# EAGLE design rfid (EAGLE 9.6.2)
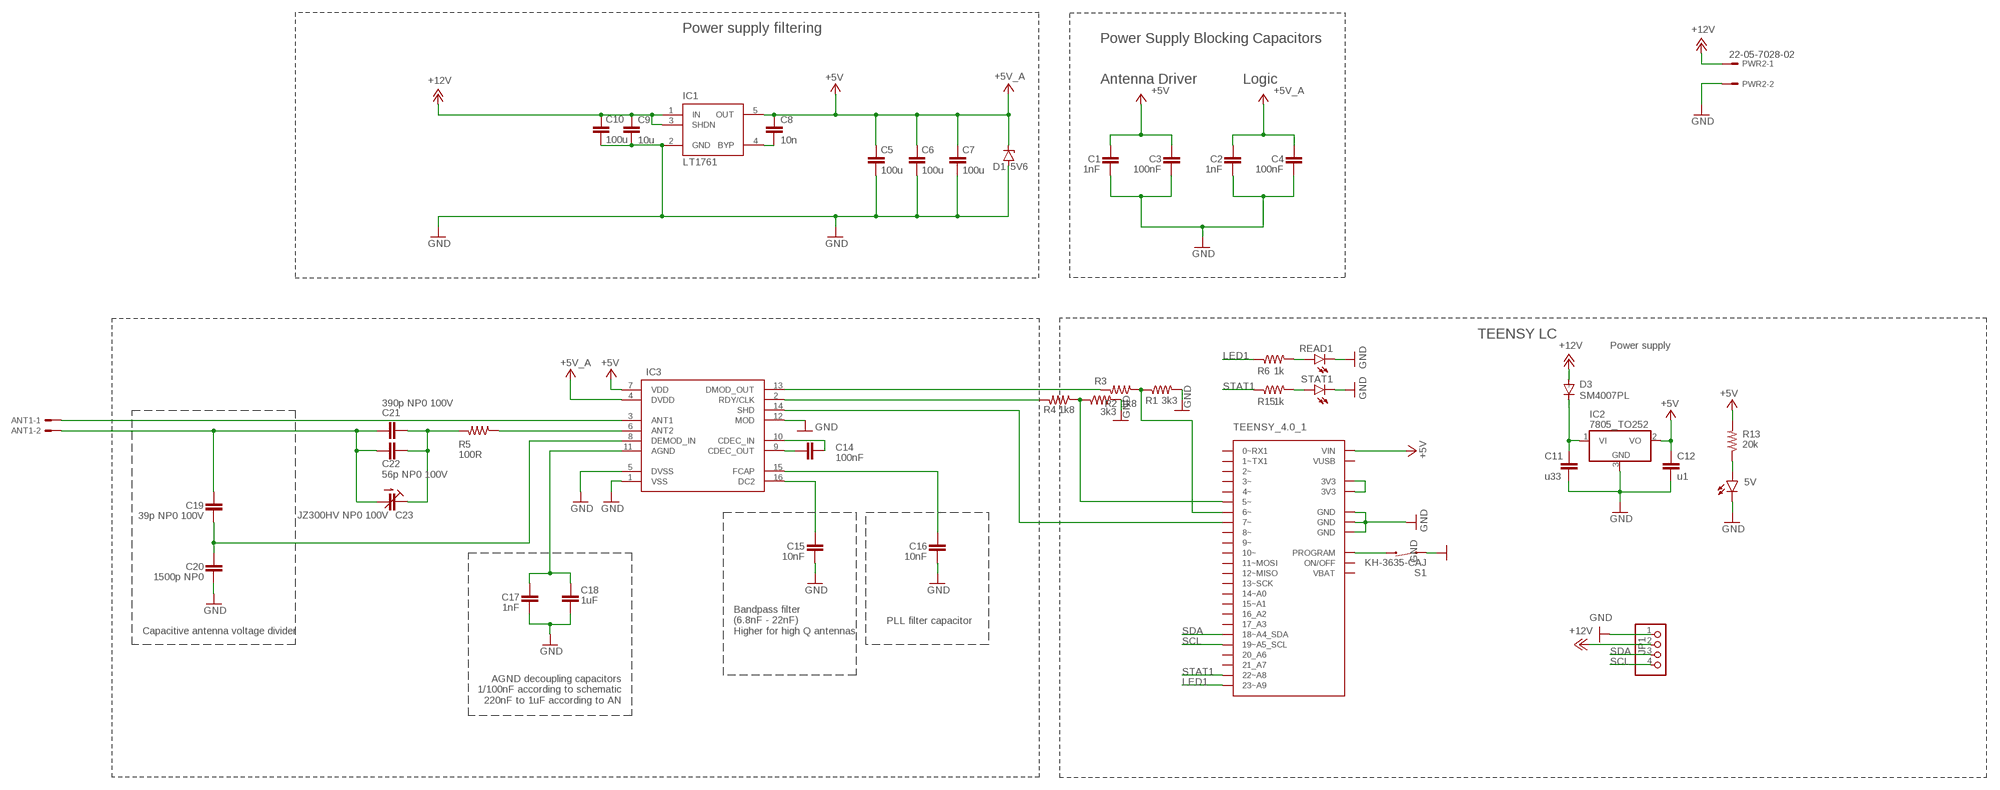
[diagram p0: schematic, sheet 1, part 1 of 2]
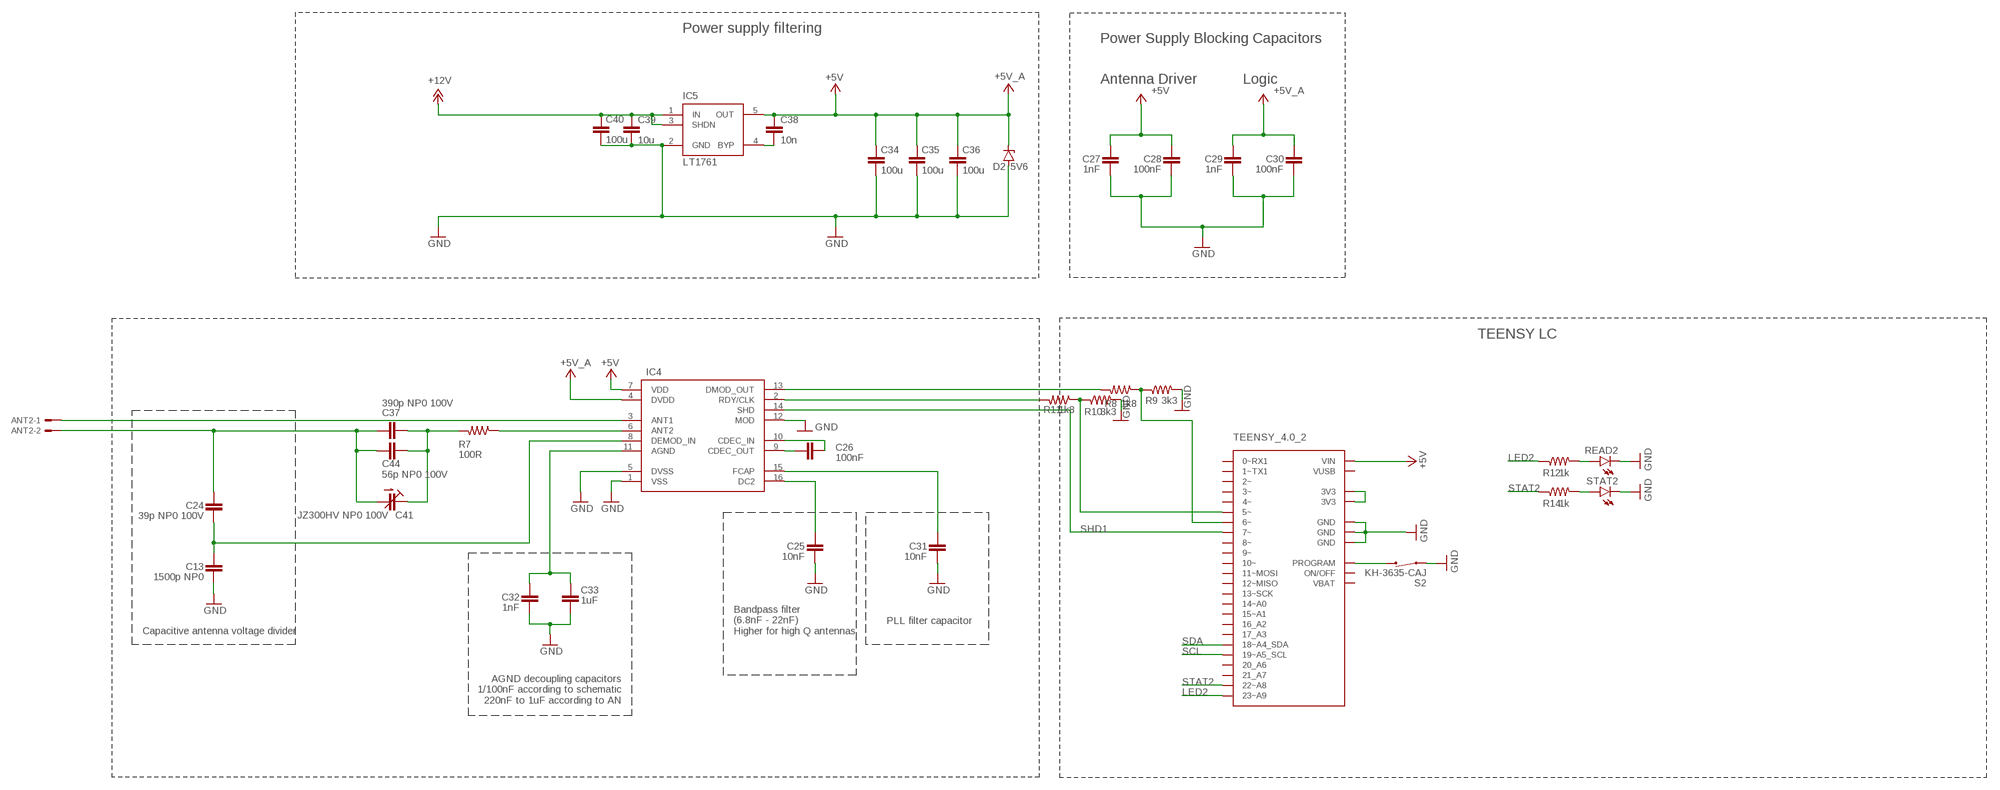
[diagram p1: schematic, sheet 1, part 2 of 2]

## Parts
5V  LEDCHIPLED_0805  [CHIPLED_0805]
ANT1  53261-02  [53261-02]
ANT2  53261-02  [53261-02]
C1  1nF  C1206  [R1206]
C2  1nF  C1206  [R1206]
C3  100nF  C1206  [R1206]
C4  100nF  C1206  [R1206]
C5  100u  C1206  [R1206]
C6  100u  C1206  [R1206]
C7  100u  C1206  [R1206]
C8  10n  C1206  [R1206]
C9  10u  C1206  [R1206]
C10  100u  C1206  [R1206]
C11  u33  C-EUC0805  [C0805]
C12  u1  C-EUC0805  [C0805]
C13  1500p NP0  C1206  [R1206]
C14  100nF  C1206  [R1206]
C15  10nF  C1206  [R1206]
C16  10nF  C1206  [R1206]
C17  1nF  C1206  [R1206]
C18  1uF  C1206  [R1206]
C19  39p NP0 100V  C1206  [R1206]
C20  1500p NP0  C1206  [R1206]
C21  390p NP0 100V  C1206  [R1206]
C22  56p NP0 100V  C1206  [R1206]
C23  JZ300HV NP0 100V  JZ300HV  [JZ300HV]
C24  39p NP0 100V  C1206  [R1206]
C25  10nF  C1206  [R1206]
C26  100nF  C1206  [R1206]
C27  1nF  C1206  [R1206]
C28  100nF  C1206  [R1206]
C29  1nF  C1206  [R1206]
C30  100nF  C1206  [R1206]
C31  10nF  C1206  [R1206]
C32  1nF  C1206  [R1206]
C33  1uF  C1206  [R1206]
C34  100u  C1206  [R1206]
C35  100u  C1206  [R1206]
C36  100u  C1206  [R1206]
C37  390p NP0 100V  C1206  [R1206]
C38  10n  C1206  [R1206]
C39  10u  C1206  [R1206]
C40  100u  C1206  [R1206]
C41  JZ300HV NP0 100V  JZ300HV  [JZ300HV]
C44  56p NP0 100V  C1206  [R1206]
D1  5V6  ZENER-DIODESOD80C  [SOD80C]
D2  5V6  ZENER-DIODESOD80C  [SOD80C]
D3  SM4007PL  CGRM4007-G  [SOD-123_MINI-SMA]
IC1  LT1761  [TSOT23-5]
IC2  7805_TO252  [TO252]
IC3  EM4095  [SO16]
IC4  EM4095  [SO16]
IC5  LT1761  [TSOT23-5]
JP1  PINHD-1X4  [1X04]
PWR2  22-05-7028-02  [7395-02]
R1  3k3  R-US_R0805  [R0805]
R2  1k8  R-US_R0805  [R0805]
R3  3k3  R-US_R0805  [R0805]
R4  1k8  R-US_R0805  [R0805]
R5  100R  R1206  [R1206]
R6  1k  R-US_R0805  [R0805]
R7  100R  R1206  [R1206]
R8  1k8  R-US_R0805  [R0805]
R9  3k3  R-US_R0805  [R0805]
R10  3k3  R-US_R0805  [R0805]
R11  1k8  R-US_R0805  [R0805]
R12  1k  R-US_R0805  [R0805]
R13  20k  R-US_R0805  [R0805]
R14  1k  R-US_R0805  [R0805]
R15  1k  R-US_R0805  [R0805]
READ1  LEDCHIPLED_0805  [CHIPLED_0805]
READ2  LEDCHIPLED_0805  [CHIPLED_0805]
S1  KH-3635-CAJ  [KH-3635-CAJ]
S2  KH-3635-CAJ  [KH-3635-CAJ]
STAT1  LEDCHIPLED_0805  [CHIPLED_0805]
STAT2  LEDCHIPLED_0805  [CHIPLED_0805]
TEENSY_4.0_1  TEENSY40  [TEENSY40]
TEENSY_4.0_2  TEENSY40  [TEENSY40]

## Nets
+5V: C1.2 C2.2 C3.2 C4.2 C5.1 C6.1 C7.1 C8.1 C12.1 C27.2 C28.2 C29.2 C30.2 C34.1 C35.1 C36.1 C38.1 D1.C D2.C IC1.5(OUT) IC2.2(VO) IC3.4(DVDD) IC3.7(VDD) IC4.4(DVDD) IC4.7(VDD) IC5.5(OUT) R13.2 TEENSY_4.0_1.VIN TEENSY_4.0_2.VIN ; supply symbol labelled +5V_A
+12V: C9.1 C10.1 C39.1 C40.1 D3.A IC1.1(IN) IC1.3(SHDN) IC5.1(IN) IC5.3(SHDN) JP1.2 PWR2.1
AGND: C17.2 C18.2 IC3.11(AGND)
AGND1: C32.2 C33.2 IC4.11(AGND)
ANT2: IC3.6(ANT2) R5.1
ANT3: IC4.6(ANT2) R7.1
ANT4: ANT2.1 IC4.3(ANT1)
CDEC_IN: C14.2 IC3.10(CDEC_IN)
CDEC_IN1: C26.2 IC4.10(CDEC_IN)
CDEC_OUT: C14.1 IC3.9(CDEC_OUT)
CDEC_OUT1: C26.1 IC4.9(CDEC_OUT)
DC1: C25.1 IC4.16(DC2)
DC2: C15.1 IC3.16(DC2)
DMODI: C19.1 C20.2 IC3.8(DEMOD_IN)
DMODI1: C13.2 C24.1 IC4.8(DEMOD_IN)
FCAP: C16.1 IC3.15(FCAP)
FCAP1: C31.1 IC4.15(FCAP)
GND: 5V.C C1.1 C2.1 C3.1 C4.1 C5.2 C6.2 C7.2 C9.2 C10.2 C11.2 C12.2 C13.1 C15.2 C16.2 C17.1 C18.1 C20.1 C25.2 C27.1 C28.1 C29.1 C30.1 C31.2 C32.1 C33.1 C34.2 C35.2 C36.2 C39.2 C40.2 D1.A D2.A IC1.2(GND) IC2.3(GND) IC3.1(VSS) IC3.5(DVSS) IC3.12(MOD) IC4.1(VSS) IC4.5(DVSS) IC4.12(MOD) IC5.2(GND) JP1.1 PWR2.2 R1.2 R3.2 R9.2 R10.2 READ1.C READ2.C S1.P$1 S2.P$1 STAT1.C STAT2.C TEENSY_4.0_1.GND TEENSY_4.0_1.GND@1(GND) TEENSY_4.0_1.GND@2(GND) TEENSY_4.0_2.GND TEENSY_4.0_2.GND@1(GND) TEENSY_4.0_2.GND@2(GND)
LED1: R6.1 TEENSY_4.0_1.23(23~A9)
LED2: R12.1 TEENSY_4.0_2.23(23~A9)
N$1: R6.2 READ1.A
N$2: R3.1 R4.1 TEENSY_4.0_1.5(5~)
N$3: ANT2.2 C24.2 C37.1 C41.P$1(A) C44.1
N$4: C37.2 C41.P$2(E) C44.2 R7.2
N$5: C21.2 C22.2 C23.P$2(E) R5.2
N$6: R1.1 R2.1 TEENSY_4.0_1.6(6~)
N$7: C8.2 IC1.4(BYP)
N$8: S1.P$2 TEENSY_4.0_1.PROG(PROGRAM)
N$9: C38.2 IC5.4(BYP)
N$10: TEENSY_4.0_1.3V3 TEENSY_4.0_1.3V3@2(3V3)
N$11: R8.1 R9.1 TEENSY_4.0_2.6(6~)
N$12: R10.1 R11.1 TEENSY_4.0_2.5(5~)
N$13: R12.2 READ2.A
N$14: ANT1.2 C19.2 C21.1 C22.1 C23.P$1(A)
N$15: IC3.14(SHD) TEENSY_4.0_1.7(7~)
N$16: S2.P$2 TEENSY_4.0_2.PROG(PROGRAM)
N$17: TEENSY_4.0_2.3V3 TEENSY_4.0_2.3V3@2(3V3)
N$18: R14.2 STAT2.A
N$19: R15.2 STAT1.A
N$20: ANT1.1 IC3.3(ANT1)
N$21: C11.1 D3.C IC2.1(VI)
N$22: IC4.13(DMOD_OUT) R8.2
N$23: IC3.2(RDY/CLK) R4.2
N$24: IC3.13(DMOD_OUT) R2.2
N$25: 5V.A R13.1
N$26: IC4.2(RDY/CLK) R11.2
SCL: JP1.4 TEENSY_4.0_1.19(19~A5_SCL) TEENSY_4.0_2.19(19~A5_SCL)
SDA: JP1.3 TEENSY_4.0_1.18(18~A4_SDA) TEENSY_4.0_2.18(18~A4_SDA)
SHD1: IC4.14(SHD) TEENSY_4.0_2.7(7~)
STAT1: R15.1 TEENSY_4.0_1.22(22~A8)
STAT2: R14.1 TEENSY_4.0_2.22(22~A8)
Unconnected: TEENSY_4.0_1.0(0~RX1) TEENSY_4.0_1.1(1~TX1) TEENSY_4.0_1.2(2~) TEENSY_4.0_1.3(3~) TEENSY_4.0_1.4(4~) TEENSY_4.0_1.8(8~) TEENSY_4.0_1.9(9~) TEENSY_4.0_1.10(10~) TEENSY_4.0_1.11(11~MOSI) TEENSY_4.0_1.12(12~MISO) TEENSY_4.0_1.13(13~SCK) TEENSY_4.0_1.14(14~A0) TEENSY_4.0_1.15(15~A1) TEENSY_4.0_1.16(16_A2) TEENSY_4.0_1.17(17_A3) TEENSY_4.0_1.20(20_A6) TEENSY_4.0_1.21(21_A7) TEENSY_4.0_1.ON/OFF TEENSY_4.0_1.VBAT TEENSY_4.0_1.VUSB TEENSY_4.0_2.0(0~RX1) TEENSY_4.0_2.1(1~TX1) TEENSY_4.0_2.2(2~) TEENSY_4.0_2.3(3~) TEENSY_4.0_2.4(4~) TEENSY_4.0_2.8(8~) TEENSY_4.0_2.9(9~) TEENSY_4.0_2.10(10~) TEENSY_4.0_2.11(11~MOSI) TEENSY_4.0_2.12(12~MISO) TEENSY_4.0_2.13(13~SCK) TEENSY_4.0_2.14(14~A0) TEENSY_4.0_2.15(15~A1) TEENSY_4.0_2.16(16_A2) TEENSY_4.0_2.17(17_A3) TEENSY_4.0_2.20(20_A6) TEENSY_4.0_2.21(21_A7) TEENSY_4.0_2.ON/OFF TEENSY_4.0_2.VBAT TEENSY_4.0_2.VUSB

## Notes on the sheet
- Power supply filtering | Power supply filtering
- Power Supply Blocking Capacitors | Power Supply Blocking Capacitors
- Antenna Driver | Logic | Antenna Driver | Logic
- TEENSY LC | TEENSY LC
- Power supply
- PLL filter capacitor | PLL filter capacitor
- Capacitive antenna voltage divider
- Bandpass filter
  (6.8nF - 22nF)
  Higher for high Q antennas
- Capacitive antenna voltage divider
- Bandpass filter
  (6.8nF - 22nF)
  Higher for high Q antennas
- AGND decoupling capacitors
  1/100nF according to schematic
  220nF to 1uF according to AN
- AGND decoupling capacitors
  1/100nF according to schematic
  220nF to 1uF according to AN

## Library data of the parts
5V READ1 READ2 STAT1 STAT2 = led:LED: LED OSRAM: - CHIPLED LG R971, LG N971, LY N971, LG Q971, LY Q971, LO R971, LY R971 LH N974, LH R974 LS Q976, LO Q976, LY Q976 LO Q996 - Hyper CHIPLED LW Q18S LB Q993, LB Q99A, LB R99A - SideLED LS A670, LO A670, LY A670, LG A670, LP A670 LB A673, LV A673, LT A673, LW A673 LH A674 LY A675 LS A676, LA A676, LO A676, LY A676, LW A676 LS A679, LY A679, LG A679 - Hyper Micro SIDELED® LS Y876, LA Y876, LO Y876, LY Y876 LT Y87S - SmartLED LW L88C, LW L88S LB L89C, LB L89S, LG L890 LS L89K, LO L89K, LY L89K LS L896, LA L896, LO L896, LY L896 - TOPLED LS T670, LO T670, LY T670, LG T670, LP T670 LSG T670, LSP T670, LSY T670, LOP T670, LYG T670 LG T671, LOG T671, LSG T671 LB T673, LV T673, LT T673, LW T673 LH T674 LS T676, LA T676, LO T676, LY T676, LB T676, LH T676, LSB T676, LW T676 LB T67C, LV T67C, LT T67C, LS T67K, LO T67K, LY T67K, LW E67C LS E67B, LA E67B, LO E67B, LY E67B, LB E67C, LV E67C, LT E67C LW T67C LS T679, LY T679, LG T679 LS T770, LO T770, LY T770, LG T770, LP T770 LB T773, LV T773, LT T773, LW T773 LH T774 LS E675, LA E675, LY E675, LS T675 LS T776, LA T776, LO T776, LY T776, LB T776 LHGB T686 LT T68C, LB T68C - Hyper Mini TOPLED® LB M676 - Mini TOPLED Santana® LG M470 LS M47K, LO M47K, LY M47K Source: http://www.osram.convergy.de LUXEON: - LUMILED® LXK2-PW12-R00, LXK2-PW12-S00, LXK2-PW14-U00, LXK2-PW14-V00 LXK2-PM12-R00, LXK2-PM12-S00, LXK2-PM14-U00 LXK2-PE12-Q00, LXK2-PE12-R00, LXK2-PE12-S00, LXK2-PE14-T00, LXK2-PE14-U00 LXK2-PB12-K00, LXK2-PB12-L00, LXK2-PB12-M00, LXK2-PB14-N00, LXK2-PB14-P00, LXK2-PB14-Q00 LXK2-PR12-L00, LXK2-PR12-M00, LXK2-PR14-Q00, LXK2-PR14-R00 LXK2-PD12-Q00, LXK2-PD12-R00, LXK2-PD12-S00 LXK2-PH12-R00, LXK2-PH12-S00 LXK2-PL12-P00, LXK2-PL12-Q00, LXK2-PL12-R00 Source: www.luxeon.com KINGBRIGHT: KA-3528ASYC Source: www.kingbright.com
ANT1 ANT2 = con-molex:53?-02: CONNECTOR wire to board 1.25 mm (.049 inch) pitch header; MF: MOLEX; OC_FARNELL: 1125373; OC_NEWARK: unknown
C1-C10 C13-C22 C24-C40 C44 = 000-my_library:C1206
C11 C12 = rcl:C-EU: CAPACITOR, European symbol; SPICEPREFIX: C
C23 C41 = 000-my_library:JZ300HV
D1 D2 = diode:ZENER-DIODE: Z-Diode
D3 = diode:CGRM400*-G: Molded plasitc,JEDEC SOD-123/Mini SMA Source: Comchip CGRM4001-G.pdf
IC1 IC5 = 000-my_library:LT1761
IC2 = 000-my_library:7805_TO252
IC3 IC4 = 000-my_library:EM4095
JP1 = pinhead:PINHD-1X4: PIN HEADER
PWR2 = con-molex:22-?-02: CONNECTOR wire to board 2.54 mm (.1 inch) pitch header; MF: MOLEX; OC_FARNELL: 9731601; OC_NEWARK: unknown
R1-R4 R6 R8-R15 = rcl:R-US_: RESISTOR, American symbol; SPICEPREFIX: R
R5 R7 = 000-my_library:R1206
S1 S2 = 000-my_library:KH-3635-CAJ
TEENSY_4.0_1 TEENSY_4.0_2 = 000-my_library:TEENSY40

## Board
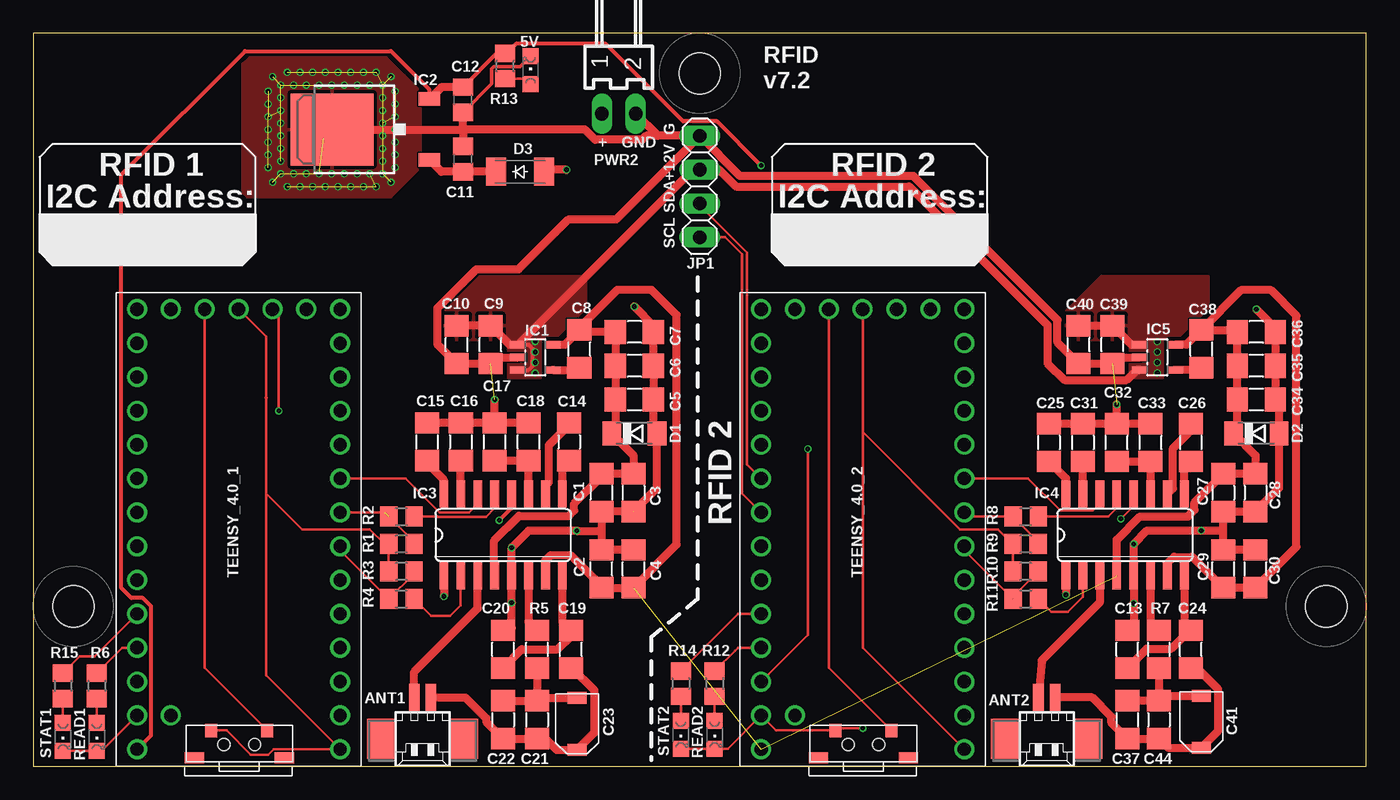
[diagram p2: board, top side]
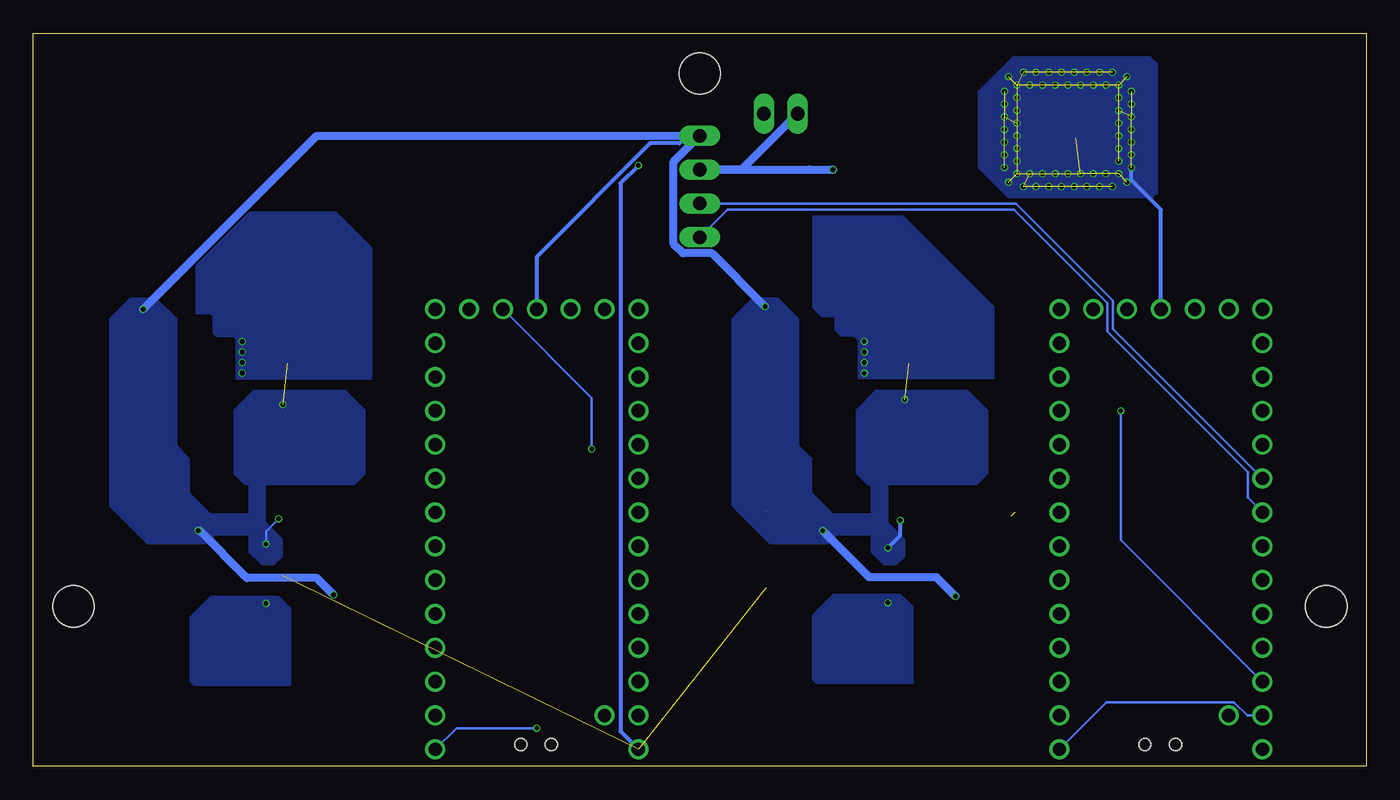
[diagram p3: board, bottom side, seen from below]

Size 100 x 55 mm. Coordinates in mm from the lower left corner, seen from the top.
Outline: 0,0 100,0 100,55 0,55 0,0
Copper layers (1*16): Top 0.035559375mm / dielectric 1.6mm / Bottom 0.035559375mm
Design rules "jlcpcb2layer": minimum track width 5mil, minimum drill 12mil, track to track 5mil, track to pad 5mil, pad to pad 5mil, via to via 5mil, smd to smd 5mil, copper to edge 8mil, drill to drill 6mil, minimum pad ring 5mil, minimum via ring 3mil, stop-mask expansion 2.5mil, vias tented up to drill 0mil, thermal gap 10mil
Holes 3.1 mm at 50,52 3,12 97,12

### Footprints (pad centres in the part's own frame; a part is rotated, then mirrored left to right if it is on the bottom)
CHIPLED_0805 = smd 1.2 x 1.2: A 0,-1.05; C 0,1.05
53261-02 = smd 0.8 x 2: 1 0.625,-2.5; 2 -0.625,-2.5 | smd 2.1 x 3: S1 3.125,0.625; S2 -3.125,0.625
R1206 = smd 1.6 x 1.803: 1 -1.422,0; 2 1.422,0
C0805 = smd 1.3 x 1.5: 1 -0.95,0; 2 0.95,0
JZ300HV = smd 0.9 x 1.4: P$1 -1.95,0; P$2 1.95,0
SOD80C = smd 1.4 x 1.8: A 1.7,0; C -1.7,0
SOD-123_MINI-SMA = smd 1.5 x 2.1: A 1.8,0; C -1.8,0
TSOT23-5 = smd 0.55 x 1.2: 1 -0.95,-1.3; 2 0,-1.3; 3 0.95,-1.3; 4 0.95,1.3; 5 -0.95,1.3
TO252 = smd 1 x 1.6: 1 -2.28,-4.8; 2 2.28,-4.8 | smd 5.4 x 6.2: 3 0,2.5
SO16 = smd 0.66 x 2.032: 1 -4.445,-3.073; 2 -3.175,-3.073; 3 -1.905,-3.073; 4 -0.635,-3.073; 5 0.635,-3.073; 6 1.905,-3.073; 7 3.175,-3.073; 8 4.445,-3.073; 9 4.445,3.073; 10 3.175,3.073; 11 1.905,3.073; 12 0.635,3.073; 13 -0.635,3.073; 14 -1.905,3.073; 15 -3.175,3.073; 16 -4.445,3.073
1X04 = drill 1.016 long: 1 -3.81,0; 2 -1.27,0; 3 1.27,0; 4 3.81,0
7395-02 = drill 1.016 long: 1 1.27,0; 2 -1.27,0
R0805 = smd 1.3 x 1.5: 1 -0.95,0; 2 0.95,0
KH-3635-CAJ = smd 0.9 x 1: P$1 -2.1,1.05; P$2 2.1,1.05 | smd 1.45 x 0.8: P$3 -3.375,-1; P$4 3.375,-1 | hole 0.9: -1.15,0; 1.15,0
TEENSY40 = drill 1: 0 -13.97,-7.62; 1 -11.43,-7.62; 2 -8.89,-7.62; 3 -6.35,-7.62; 3V3 -11.43,7.62; 3V3@2 16.51,-2.54; 4 -3.81,-7.62; 5 -1.27,-7.62; 6 1.27,-7.62; 7 3.81,-7.62; 8 6.35,-7.62; 9 8.89,-7.62; 10 11.43,-7.62; 11 13.97,-7.62; 12 16.51,-7.62; 13 16.51,7.62; 14 13.97,7.62; 15 11.43,7.62; 16 8.89,7.62; 17 6.35,7.62; 18 3.81,7.62; 19 1.27,7.62; 20 -1.27,7.62; 21 -3.81,7.62; 22 -6.35,7.62; 23 -8.89,7.62; GND -16.51,-7.62; GND@1 -13.97,7.62; GND@2 16.51,0; ON/OFF 16.51,5.08; PROG 16.51,2.54; VBAT 16.51,-5.08; VIN -16.51,7.62; VUSB -13.97,5.08

### Placement (x,y rotation side)
5V  37.31,52.23 0 top
ANT1  29.21,2.67 180 top
ANT2  76.03,2.67 180 top
C1  42.61,20.52 90 top
C2  42.61,14.81 270 top
C3  45.03,20.52 90 top
C4  45.03,14.81 270 top
C5  45.09,27.51 0 top
C6  45.09,30.05 0 top
C7  45.09,32.59 0 top
C8  40.96,31.32 270 top
C9  34.3,31.64 270 top
C10  31.76,31.64 270 top
C11  32.23,45.56 90 top
C12  32.23,50.01 270 top
C13  82.07,8.78 270 top
C14  40.2,24.34 90 top
C15  29.53,24.34 90 top
C16  32.07,24.34 90 top
C17  34.61,24.34 270 top
C18  37.15,24.34 270 top
C19  40.33,8.78 270 top
C20  35.25,8.78 270 top
C21  37.79,3.49 90 top
C22  35.25,3.49 90 top
C23  40.8,3.17 90 top
C24  86.84,8.78 270 top
C25  76.2,24.29 90 top
C26  86.84,24.29 90 top
C27  89.28,20.52 90 top
C28  91.69,20.52 90 top
C29  89.28,14.81 270 top
C30  91.69,14.81 270 top
C31  78.74,24.29 90 top
C32  81.28,24.29 270 top
C33  83.82,24.29 270 top
C34  91.76,27.51 0 top
C35  91.76,30.05 0 top
C36  91.76,32.59 0 top
C37  82.07,3.49 90 top
C38  87.63,31.32 270 top
C39  80.96,31.64 270 top
C40  78.42,31.64 270 top
C41  87.63,3.33 90 top
C44  84.45,3.49 90 top
D1  45.09,24.97 0 top
D2  91.76,24.97 0 top
D3  36.51,44.61 0 top
IC1  37.66,30.68 270 top
IC2  24.92,47.78 90 top
IC3  35.25,17.35 0 top
IC4  81.92,17.35 0 top
IC5  84.33,30.68 270 top
JP1  50,43.5 270 top
PWR2  43.92,48.97 180 top
R1  27.62,16.67 180 top
R2  27.62,18.73 0 top
R3  27.62,14.61 180 top
R4  27.62,12.54 0 top
R5  37.79,8.78 270 top
R6  4.76,6.03 270 top
R7  84.45,8.78 270 top
R8  74.46,18.73 0 top
R9  74.45,16.67 180 top
R10  74.45,14.61 180 top
R11  74.46,12.54 0 top
R12  51.12,6.19 270 top
R13  35.4,52.55 90 top
R14  48.58,6.19 270 top
R15  2.22,6.03 270 top
READ1  4.76,2.22 180 top
READ2  51.12,2.38 180 top
S1  15.46,1.63 0 top
S2  62.28,1.63 0 top
STAT1  2.22,2.22 180 top
STAT2  48.58,2.38 180 top
TEENSY_4.0_1  15.4,17.78 90 top
TEENSY_4.0_2  62.22,17.78 90 top

### Tracks (layer width: path | path; a pad name or v marks a point on that pad's centre or on a via)
+5V  (via drill 0.35)  (2 unrouted)
  Top 0.203: 29.69,50.1 IC2.2 | 32.7,51.12 32.38,51.12 32.23,51.12
  Top 0.305: v54.61,45.09 51.29,48.4 48.75,48.4 42.94,54.21 36.21,54.21 35.5,53.5 R13.2 34.77,53.5 C12.1 | 29.69,50.1 29.69,50.8 26.83,53.66 15.88,53.66 6.6,44.38 6.6,13.38 7.35,12.62 8.2,12.62 8.81,12.02 8.81,2.3 TEENSY_4.0_1.VIN
  Top 0.406: C12.1 32.23,51.12
  Top 0.61: IC3.4 34.57,14.32 34.57,16.94 36.43,18.8 40.2,18.8 40.58,19.18 40.58,19.7 42.62,21.73 C1.2 C3.2 45.03,23.33 D1.C 43.69,25.27 | IC3.7 38.42,15.45 38.83,15.85 40.3,15.85 42.62,13.54 C2.2 C4.2 48.27,16.64 48.27,33.86 46.36,35.77 43.82,35.77 41.28,33.23 41.28,33.04 | 40.97,32.73 41.28,33.04 | 43.69,25.27 43.69,27.51 C5.1 C6.1 C7.1 | 43.69,25.27 D1.C | C7.1 | C7.1 41.1,32.59 C8.1 | IC1.5 39.88,31.64 | 39.88,31.64 40.71,32.47 | 40.71,32.47 40.97,32.73 | IC2.2 30.62,50.96 C12.1 30.59,50.96 | IC4.4 81.28,16.99 83.03,18.73 86.63,18.73 87.12,19.23 87.12,19.79 C27.2 C28.2 91.69,23.33 D2.C 90.33,25.25 C34.1 C35.1 C36.1 90.18,32.74 C38.1 | C38.1 86.52,31.64 IC5.5 | IC4.7 85.09,15.24 85.57,15.72 86.94,15.72 C29.2 C30.2 94.77,16.47 94.77,33.81 92.87,35.72 90.61,35.72 C38.1 | 32.38,50.91 32.38,51.12 | IC1.5 39.88,31.64 | 40.71,32.47 40.96,32.72 C8.1 | C8.1 40.97,32.73 | C8.1 40.98,32.74 41.28,33.04
  Bottom 0.305: v54.61,45.09 55.96,43.74 55.96,2.62 TEENSY_4.0_2.VIN
+12V  (via drill 0.35)
  Top 0.305: IC1.1 37.16,31.64 37.47,31.32 37.47,30.05 37.16,29.73 IC1.3
  Top 0.61: C9.1 C10.1 | C40.1 C39.1 82.39,31.64 IC5.1 | IC5.3 82.79,29.73 82.04,28.98 77.34,28.98 76.1,30.23 76.1,33.12 65.72,43.5 52.7,43.5 51.43,44.77 JP1.2 49.5,44.77 IC1.1 35.72,31.64 C9.1 | C9.1 34.94,33.06 | v40.01,44.77 38.47,44.77 D3.A
  Bottom 0.61: PWR2.1 46.85,44.77 JP1.2 41.75,44.77 v40.01,44.77
  other vias: 37.66,29.5 37.66,31.08 37.66,30.29 37.66,31.88 84.33,31.87 84.33,31.08 84.33,30.29 84.33,29.5
  pour Top (no thermals): 35.57,29.1 38.11,29.1 38.11,31.95 38.42,32.27 39.38,32.27 41.5,34.4 41.5,36.82 33.46,36.82 31.14,34.49 35.57,34.49
  pour Top: 35.57,31.95 30.8,31.95 30.8,34.18 31.12,34.49 35.57,34.49
  pour Bottom (no thermals): 27.94,34.45 34.77,41.27 41.51,41.27 41.51,34.42 40.82,33.73 39.85,33.73 39.85,32.75 39.37,32.28 38.42,32.28 38.11,31.97 38.11,29.11 38.1,29.1 27.94,29.1
  pour Bottom: 74.61,29.05 84.77,29.05 84.77,32.07 84.93,32.23 86.2,32.23 86.52,32.54 86.52,33.81 86.68,33.97 87.79,33.97 87.79,37.94 84.14,41.59 77.31,41.59 74.61,38.89
  pour Top (no thermals): 82.24,29.1 84.78,29.1 84.78,31.95 85.1,32.27 86.05,32.27 88.18,34.4 88.18,36.82 80.13,36.82 77.81,34.49 82.24,34.49
  pour Top: 82.24,31.95 77.48,31.95 77.48,34.18 77.79,34.49 82.24,34.49
AGND
  Top 0.61: IC3.11 C18.2 C17.2
AGND1
  Top 0.61: C32.2 C33.2 IC4.11
ANT2
  Top 0.61: IC3.6 37.15,10.84 R5.1
ANT3
  Top 0.61: IC4.6 83.82,10.84 R7.1
ANT4
  Top 0.61: IC4.3 80.01,12.28 75.66,7.92 ANT2.1
CDEC_IN
  Top 0.61: IC3.10 38.42,21.06 38.68,21.31 38.68,24.09 40.2,25.62 C14.2
CDEC_IN1
  Top 0.61: C26.2 86.84,25.18 85.5,23.85 85.5,20.84 IC4.10
CDEC_OUT
  Top 0.508: C14.1 39.98,22.93 39.69,22.65
  Top 0.61: IC3.9 39.69,22.65
CDEC_OUT1
  Top 0.61: IC4.9 86.36,22.39 C26.1
DC1
  Top 0.61: IC4.16 77.47,21.6 C25.1
DC2
  Top 0.61: IC3.16 30.8,21.48 29.53,22.75 C15.1
DMODI
  Top 0.61: C20.2 36.65,8.78 39.35,8.78 40.33,9.76 C19.1 39.69,10.81 IC3.8
DMODI1
  Top 0.61: IC4.8 86.36,10.68 C24.1 86.77,10.2 85.38,8.81 83.53,8.81 C13.2
FCAP
  Top 0.61: IC3.15 C16.1
FCAP1
  Top 0.61: IC4.15 C31.1
GND  (via drill 0.35)  (67 unrouted)
  Top 0.2: 17.46,22.54 17.46,6.83 TEENSY_4.0_1.GND | 62.23,25.56 62.23,8.89 TEENSY_4.0_2.GND | S2.P$1 60.36,2.86 v62.23,2.86
  Top 0.203: IC4.12 82.55,19.53 v81.6,18.57 | 51.14,1.32 51.14,1.46 51.03,1.32 | S1.P$1 14.49,2.68 16.29,0.87 17.63,0.87 18.03,1.27 TEENSY_4.0_1.GND | STAT1.C READ1.C 5.14,1.17 TEENSY_4.0_1.GND@1 | STAT2.C 51.03,1.32 | READ2.C 51.48,1.32 | TEENSY_4.0_1.GND@2 17.46,32.23 17.46,27.62 17.46,22.54 17.46,20.48 20.16,17.78 25.24,17.78 26.36,16.67 R1.2 R3.2 | TEENSY_4.0_2.GND@2 62.22,33.97 62.23,33.97 62.23,25.56 62.23,25.08 69.53,17.78 72.39,17.78 R9.2 R10.2 | S2.P$1 55.74,2.68 TEENSY_4.0_2.GND@1 52.12,1.32 READ2.C | 51.03,1.32 READ2.C
  Top 0.254: 17.46,27.62 17.46,27.66 | 5V.C 36.53,52.5 34.55,52.5 34.4,52.35 34.4,51.23 C12.2
  Top 0.305: IC3.12 35.88,19.38 v34.96,18.45 | C20.1 35.43,10.37 35.72,10.37 35.88,10.37
  Top 0.61: C15.2 C16.2 C17.1 | 35.88,10.37 v35.88,12.27 IC3.5 v35.88,16.4 37.15,17.67 v40.77,17.67 42.62,17.67 | C3.1 C1.1 42.62,17.67 | C4.1 C2.1 42.62,17.67 | C18.1 C17.1 | C17.1 v34.61,27.51 | IC3.1 v30.8,12.75 | C3.1 46.75,20.83 46.75,24.92 D1.A | C7.2 46.55,32.65 | 46.55,32.65 46.55,33.04 v45.09,34.49 | D1.A | C10.2 31.39,30.6 | 31.39,30.6 30.3,31.69 30.3,34.35 33.25,37.3 36.41,37.3 40.16,41.05 43.74,41.05 JP1.1 | IC1.2 34.74,30.68 34.29,30.23 C9.2 C10.2 31.76,30.23 31.39,30.6 | 21.79,47.15 IC2.3 32.23,47.78 | 32.23,47.78 C12.2 | 32.23,47.78 C11.2 | C25.2 C31.2 C32.1 | C32.1 C33.1 | C32.1 v81.28,27.15 | C13.1 82.55,10.68 v82.55,12.22 IC4.5 v82.55,16.67 83.56,17.68 v87.63,17.68 89.28,17.68 | C30.1 C29.1 89.28,17.68 | 89.28,17.68 C27.1 C28.1 93.46,20.87 D2.A 93.46,27.23 C34.2 C35.2 C36.2 93.18,32.87 v91.76,34.29 | IC5.2 81.43,30.68 C39.2 C40.2 76.83,31.8 76.83,33.5 66.04,44.29 53.02,44.29 JP1.1 | IC4.1 v77.47,12.86 | D1.A | D1.A | D1.A 46.49,25.27 46.49,27.51 C5.2 C6.2 C7.2 46.51,32.61 46.55,32.65 | C20.1 35.55,10.2 35.72,10.37 | 32.23,47.78 41.39,47.78 42.16,47.01 45.69,47.01 45.99,47.31 JP1.1 | JP1.1 46.85,47.31 PWR2.2
  Bottom 0.2: TEENSY_4.0_1.GND@1 8.94,3.81 9.91,4.79 19.5,4.79 TEENSY_4.0_1.GND | v62.23,2.86 68.26,2.86 TEENSY_4.0_2.GND
  Bottom 0.203: v81.6,18.57 82.55,17.62 v82.55,16.67
  Bottom 0.305: v35.88,16.4 34.96,17.32 v34.96,18.45 | JP1.1 50.96,47.31 51.53,46.74 53.72,46.74 62.22,38.24 TEENSY_4.0_2.GND@2 | TEENSY_4.0_1.GND@2 15.4,41.75 17.62,43.97 v17.62,44.93
  Bottom 0.61: v30.8,12.75 32.23,14.18 37.28,14.18 v40.77,17.67 | v45.09,34.49 49.09,38.5 51.26,38.5 51.96,39.2 51.96,45.36 JP1.1 78.74,47.31 v91.76,34.29 | v77.47,12.86 78.74,14.13 83.98,14.13 87.53,17.68 v87.63,17.68
  other vias: 26.19,44.45 25.24,44.45 24.29,44.45 23.34,44.45 22.38,44.45 21.43,44.45 20.48,44.45 19.53,44.45 18.57,44.45 18.57,45.4 18.57,46.35 18.57,47.31 18.57,48.26 18.57,49.21 18.57,50.16 18.57,51.12 19.53,51.12 20.48,51.12 21.43,51.12 22.38,51.12 23.34,51.12 24.29,51.12 25.24,51.12 26.19,51.12 25.72,43.5 24.77,43.5 23.81,43.5 22.86,43.5 21.91,43.5 20.95,43.5 20,43.5 17.62,45.88 17.62,46.83 17.62,47.78 17.62,48.74 17.62,49.69 25.72,52.07 24.77,52.07 23.81,52.07 22.86,52.07 21.91,52.07 20.95,52.07 20,52.07 19.05,52.07 26.19,45.4 26.19,46.35 26.19,47.31 26.19,48.26 26.19,49.21 26.19,50.16 27.15,44.93 27.15,45.88 27.15,46.83 27.15,47.78 27.15,48.74 27.15,49.69 17.62,50.64 19.05,43.5 27.15,50.64 17.94,51.75 26.83,51.75 26.83,43.81 17.94,43.81
  pour Bottom: 33.98,6.24 33.98,11.95 34.93,12.9 40.01,12.9 41.6,11.32 41.6,6.55 41.28,6.24
  pour Bottom: 35.88,21.16 29.22,21.16 28.39,21.99 28.39,26.68 29.88,28.18 36.8,28.18 38.3,26.68 38.3,21.99 37.47,21.16 37.15,21.16 37.15,18.94 40.01,18.94 41.6,20.52 41.6,23.07 42.55,24.02 42.55,33.54 44.14,35.13 46.04,35.13 47.63,33.54 47.63,19.57 44.77,16.71 40.33,16.71 39.69,17.35 37.15,17.35 37.15,16.08 36.2,15.13 35.25,15.13 34.61,15.76 34.61,17.03 35.88,18.3
  pour Top: 16.19,53.18 15.72,52.7 15.72,43.02 16.03,42.7 26.83,42.7 29.05,44.93 29.05,50.64 26.51,53.18
  pour Bottom: 29.05,44.93 29.05,50.64 26.51,53.18 16.19,53.18 15.72,52.7 15.72,43.02 16.03,42.7 26.83,42.7
  pour Bottom: 82.56,21.16 75.89,21.16 75.06,21.99 75.06,26.68 76.56,28.18 83.48,28.18 84.97,26.68 84.97,21.99 84.14,21.16 83.83,21.16 83.83,18.94 86.68,18.94 88.27,20.52 88.27,23.07 89.22,24.02 89.22,33.54 90.81,35.13 92.72,35.13 94.3,33.54 94.3,19.57 91.45,16.71 87,16.71 86.37,17.35 83.83,17.35 83.83,16.08 82.87,15.13 81.92,15.13 81.29,15.76 81.29,17.03 82.56,18.3
  pour Bottom: 80.65,6.08 80.65,11.79 81.6,12.75 86.68,12.75 88.27,11.16 88.27,6.4 87.95,6.08
LED1
  Top 0.203: R6.1 6.67,8.89 TEENSY_4.0_1.23
LED2
  Top 0.203: R12.1 52.63,8.65 52.87,8.89 53.5,8.89 TEENSY_4.0_2.23
N$1
  Top 0.203: R6.2 READ1.A
N$2
  Top 0.152: R3.1 28.57,14.44 R4.1 23.02,16.2
  Top 0.203: TEENSY_4.0_1.5 23.02,16.2
N$3
  Top 0.61: C24.2 87.32,7.36 88.9,5.77 88.9,2.65 C41.P$1 85.14,1.38 C44.1 C37.1 80.89,3.25 80.89,3.72 79.44,5.17 ANT2.2
N$4
  Top 0.61: R7.2 C44.2 | C44.2 C37.2 | C44.2 84.82,5.28 C41.P$2
N$5
  Top 0.61: C22.2 C21.2 | R5.2 C21.2 | C21.2 | C21.2 37.79,5.12 C23.P$2
N$6  (1 unrouted)
  Top 0.152: R2.1 28.57,16.83 R1.1
  Top 0.203: 26.36,19.05 TEENSY_4.0_1.6
N$7
  Top 0.61: IC1.4 40.78,29.73 C8.2
N$8
  Top 0.203: S1.P$2 12.86,7.37 TEENSY_4.0_1.PROG
N$9
  Top 0.61: C38.2 87.47,29.73 IC5.4
N$10  (via drill 0.35)
  Top 0.2: TEENSY_4.0_1.3V3@2 18.41,33.81 v18.41,26.67
  Bottom 0.2: TEENSY_4.0_1.3V3 18.41,16.99 v18.41,26.67
N$11
  Top 0.2: R9.1 75.4,16.84 R8.1 70.16,18.73 TEENSY_4.0_2.6
N$12  (1 unrouted)
  Top 0.2: R10.1 73.51,12.72 R11.1
  Top 0.203: 73.5,12.54 69.84,16.19 TEENSY_4.0_2.5
N$13
  Top 0.203: R12.2 51.11,3.33 READ2.A
N$14
  Top 0.61: C19.2 40.43,7.36 42.07,5.71 42.07,2.5 C23.P$1 39.27,1.23 38.42,2.07 C21.1 C22.1 33.98,3.34 33.98,3.59 32.4,5.17 ANT1.2
N$15
  Top 0.203: IC3.14 33.34,19.71 32.69,19.05 30.48,19.05 27.94,21.59 TEENSY_4.0_1.7
N$16
  Top 0.203: S2.P$2 59.68,7.37 TEENSY_4.0_2.PROG
N$17  (via drill 0.35)
  Top 0.2: TEENSY_4.0_2.3V3 58.1,9.85 v58.1,23.81
  Bottom 0.2: v58.1,23.81 58.1,27.63 TEENSY_4.0_2.3V3@2
N$18
  Top 0.203: R14.2 STAT2.A
N$19
  Top 0.203: STAT1.A R15.2
N$20
  Top 0.61: ANT1.1 28.59,7.07 33.34,11.83 IC3.3
N$21
  Top 0.61: IC2.1 30.62,44.61 C11.1 D3.C
N$22
  Top 0.2: R8.2 80.64,18.73 81.28,19.37 IC4.13
N$23
  Top 0.2: IC3.2 32.07,12.07 31.27,11.27 29.84,11.27 R4.2
N$24
  Top 0.2: R2.2 30.33,18.73 30.34,18.72 33.96,18.72 34.61,19.37 IC3.13
N$25
  Top 0.203: R13.1 36.99,51.6 5V.A
N$26
  Top 0.2: IC4.2 78.74,12.7 77.63,11.59 76.36,11.59 R11.2
SCL
  Top 0.203: JP1.4 51.91,39.69 53.17,38.42 53.17,20.48 TEENSY_4.0_2.19
  Bottom 0.203: JP1.4 47.94,41.75 26.43,41.75 19.42,34.74 19.42,32.6 8.89,22.07 8.89,20.16 TEENSY_4.0_1.19
SDA
  Top 0.203: JP1.3 50,42.07 53.53,38.54 53.53,22.66 TEENSY_4.0_2.18
  Bottom 0.203: JP1.3 26.29,42.23 19,34.94 19,32.81 TEENSY_4.0_1.18
SHD1
  Top 0.203: TEENSY_4.0_2.7 74.63,21.59 77.05,19.18 79.5,19.18 80.01,19.68 IC4.14
STAT1
  Top 0.203: R15.1 3.5,8.26 4.6,8.26 TEENSY_4.0_1.22
STAT2
  Top 0.203: R14.1 52.87,11.43 TEENSY_4.0_2.22

### Text on the board
tNames: RFID / v7.2 | + | GND | RFID 1 | RFID 2 | I2C Address: | I2C Address: | SCL SDA+12V G | RFID 2